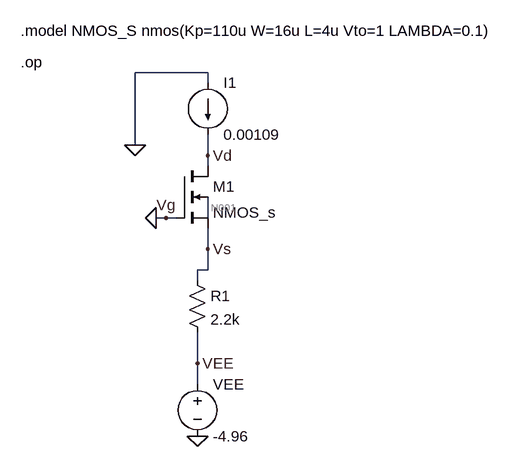
[diagram p0: schematic Exercise1.asc]
Exercise1.asc, the LTspice schematic file:
Version 4.1
SHEET 1 880 680
WIRE 64 -160 -48 -160
WIRE 64 -144 64 -160
WIRE -48 -48 -48 -160
WIRE 64 -32 64 -64
WIRE 64 -16 64 -32
WIRE 0 64 -16 64
WIRE 16 64 0 64
WIRE 64 64 64 32
WIRE 64 112 64 80
WIRE 64 144 64 112
WIRE 64 144 48 144
WIRE 48 160 48 144
WIRE 48 288 48 240
WIRE 48 320 48 288
FLAG -48 -48 0
FLAG -16 64 0
FLAG 48 400 0
FLAG 0 64 Vg
FLAG 64 -32 Vd
FLAG 64 112 Vs
FLAG 48 288 VEE
SYMBOL current 64 -144 R0
WINDOW 123 0 0 Left 0
WINDOW 39 0 0 Left 0
SYMATTR InstName I1
SYMATTR Value 0.00109
SYMBOL res 32 144 R0
SYMATTR InstName R1
SYMATTR Value 2.2k
SYMBOL nmos4 16 -16 R0
SYMATTR InstName M1
SYMATTR Value NMOS_s
SYMBOL voltage 48 304 R0
WINDOW 123 0 0 Left 0
WINDOW 39 0 0 Left 0
SYMATTR InstName VEE
SYMATTR Value -4.96
TEXT -224 -224 Left 2 !.model NMOS_S nmos(Kp=110u W=16u L=4u Vto=1 LAMBDA=0.1)
TEXT -224 -176 Left 2 !.op

The netlist it stands for:
* Exercise1.asc
I1 0 Vd 0.00109
R1 Vs VEE 2.2k
M1 Vd 0 Vs N001 NMOS_s
VEE VEE 0 -4.96
.model NMOS NMOS
.model PMOS PMOS
.lib standard.mos
.model NMOS_S nmos(Kp=110u W=16u L=4u Vto=1 LAMBDA=0.1)
.op
.backanno
.end

* Results of the author's LTspice run, read from the files saved beside the schematic
* Operating Point:
*   V(vs) = -2.562 V
*   V(n001) = -2.378 V
*   V(vd) = 7.745 V
*   V(vee) = -4.96 V
*   I(I1) = 1.09 mA
*   Id(M1) = 1.09 mA
*   Ig(M1) = 0 A
*   Is(M1) = -1.09 mA
*   Ib(M1) = 2.393 pA
*   I(R1) = 1.09 mA
*   I(VEE) = 1.09 mA